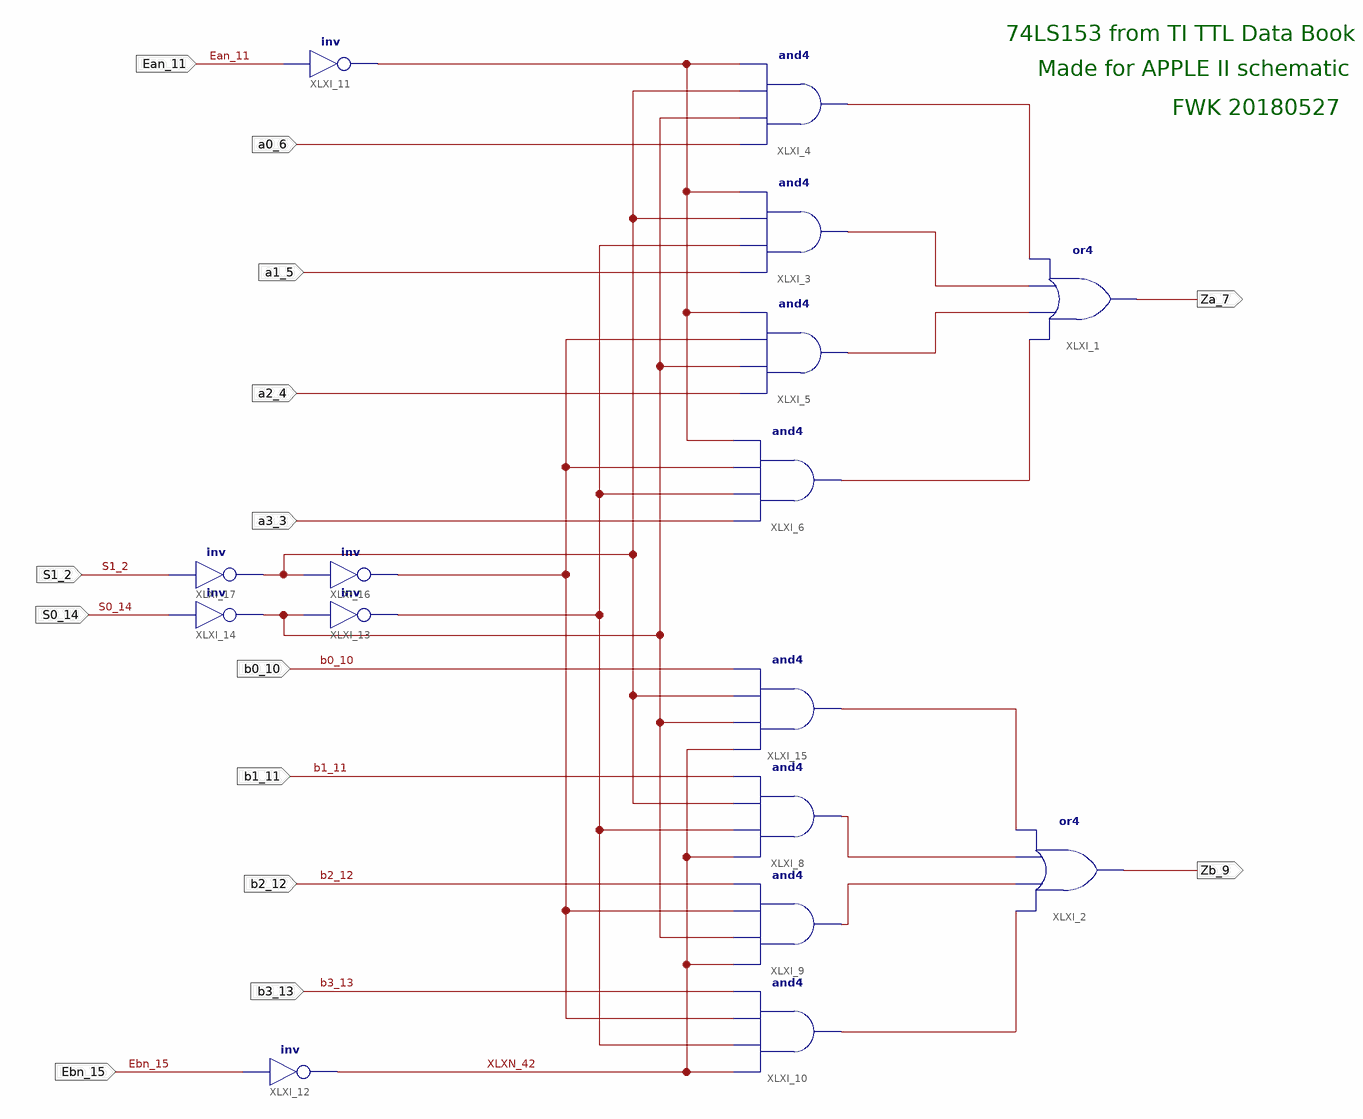
[diagram p0: schematic sheet 1]
// Xilinx ISE schematic chipi74LS153.sch (spartan3e) as structural Verilog: 16 symbols, 14 ports
module chipi74LS153 (
  input  Ebn_15,
  input  b0_10,
  input  b2_12,
  input  b3_13,
  input  Ean_11,
  input  a0_6,
  input  a1_5,
  input  a2_4,
  input  a3_3,
  input  b1_11,
  input  S0_14,
  input  S1_2,
  output Zb_9,
  output Za_7
);

  wire XLXN_1, XLXN_3, XLXN_4, XLXN_5, XLXN_6, XLXN_7, XLXN_8, XLXN_9, XLXN_14, XLXN_26, XLXN_42, XLXN_52,
       XLXN_53, XLXN_54;

  or XLXI_1 (Za_7, XLXN_5, XLXN_4, XLXN_3, XLXN_1);
  or XLXI_2 (Zb_9, XLXN_9, XLXN_8, XLXN_7, XLXN_6);
  and XLXI_3 (XLXN_3, a1_5, XLXN_26, XLXN_53, XLXN_14);
  and XLXI_4 (XLXN_1, a0_6, XLXN_52, XLXN_53, XLXN_14);
  and XLXI_5 (XLXN_4, a2_4, XLXN_52, XLXN_54, XLXN_14);
  and XLXI_6 (XLXN_5, a3_3, XLXN_26, XLXN_54, XLXN_14);
  and XLXI_8 (XLXN_7, XLXN_42, XLXN_26, XLXN_53, b1_11);
  and XLXI_9 (XLXN_8, XLXN_42, XLXN_52, XLXN_54, b2_12);
  and XLXI_10 (XLXN_9, XLXN_42, XLXN_26, XLXN_54, b3_13);
  not XLXI_11 (XLXN_14, Ean_11);
  not XLXI_12 (XLXN_42, Ebn_15);
  not XLXI_13 (XLXN_26, XLXN_52);
  not XLXI_14 (XLXN_52, S0_14);
  and XLXI_15 (XLXN_6, XLXN_42, XLXN_52, XLXN_53, b0_10);
  not XLXI_16 (XLXN_54, XLXN_53);
  not XLXI_17 (XLXN_53, S1_2);

  // Notes on the sheet:
  //   74LS153 from TI TTL Data Book
  //   Made for APPLE II schematic
  //   FWK 20180527
endmodule
